# EAGLE design Explorer_Main_Board (EAGLE 7.5.0)
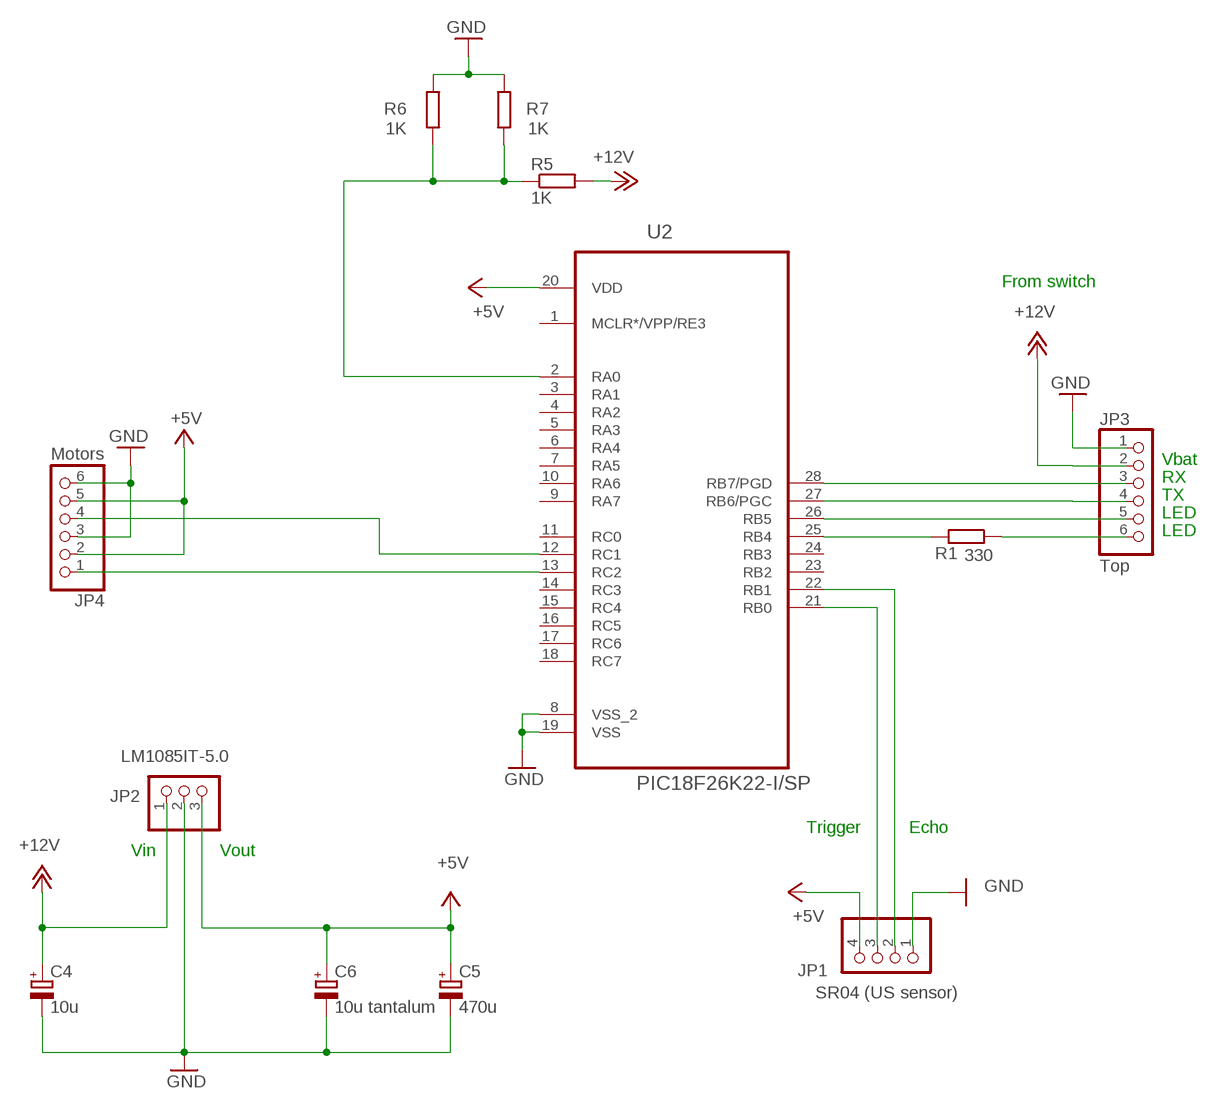
[diagram p0: schematic, sheet 1]

## Parts
C4  10u  CPOL-EUE2,5-6E  [E2,5-6E]
C5  470u  CPOL-EUE5-8.5  [E5-8,5]
C6  10u tantalum  CPOL-EUE2,5-6E  [E2,5-6E]
JP1  SR04 (US sensor)  PINHD-1X4  [1X04]
JP2  LM1085IT-5.0  PINHD-1X3  [1X03]
JP3  Top  PINHD-1X6  [1X06]
JP4  Motors  PINHD-1X6  [1X06]
R1  330  R-EU_0207/12  [0207/12]
R5  1K  R-EU_0207/12  [0207/12]
R6  1K  R-EU_0207/12  [0207/12]
R7  1K  R-EU_0207/12  [0207/12]
U2  PIC18F26K22-I/SP  [DIP254P762X508-28P]

## Nets
+5V: C5.+ C6.+ JP1.4 JP2.3 JP4.2 JP4.5 U2.20(VDD)
+12V: C4.+ JP2.1 JP3.2 R5.2
GND: C4.- C5.- C6.- JP1.1 JP2.2 JP3.1 JP4.3 JP4.6 R6.2 R7.2 U2.8(VSS_2) U2.19(VSS)
N$1: JP3.6 R1.1
N$2: R1.2 U2.25(RB4)
N$4: JP1.2 U2.22(RB1)
N$5: JP1.3 U2.21(RB0)
N$6: R5.1 R6.1 R7.1 U2.2(RA0)
N$11: JP3.3 U2.28(RB7/PGD)
N$12: JP3.4 U2.27(RB6/PGC)
N$13: JP4.4 U2.12(RC1)
N$14: JP4.1 U2.13(RC2)
N$18: JP3.5 U2.26(RB5)
Unconnected: U2.1(MCLR*/VPP/RE3) U2.3(RA1) U2.4(RA2) U2.5(RA3) U2.6(RA4) U2.7(RA5) U2.9(RA7) U2.10(RA6) U2.11(RC0) U2.14(RC3) U2.15(RC4) U2.16(RC5) U2.17(RC6) U2.18(RC7) U2.23(RB2) U2.24(RB3)

## Notes on the sheet
- From switch
- Vbat
- RX
- TX
- LED
- LED
- Trigger | Echo
- Vin | Vout

## Library data of the parts
C4-C6 = rcl:CPOL-EU: POLARIZED CAPACITOR, European symbol
JP1 = pinhead:PINHD-1X4: PIN HEADER
JP2 = pinhead:PINHD-1X3: PIN HEADER
JP3 JP4 = pinhead:PINHD-1X6: PIN HEADER
R1 R5-R7 = rcl:R-EU_: RESISTOR, European symbol
U2 = PIC18F26K22:PIC18F26K22-I/SP: MCU, 8BIT, 64K FLASH, XLP, SPDIP-28; MPN: PIC18F26K22-I/SP; OC_FARNELL: 1814975; OC_NEWARK: 65T6686; PACKAGE: SPDIP-28; SUPPLIER: MICROCHIP

## Board
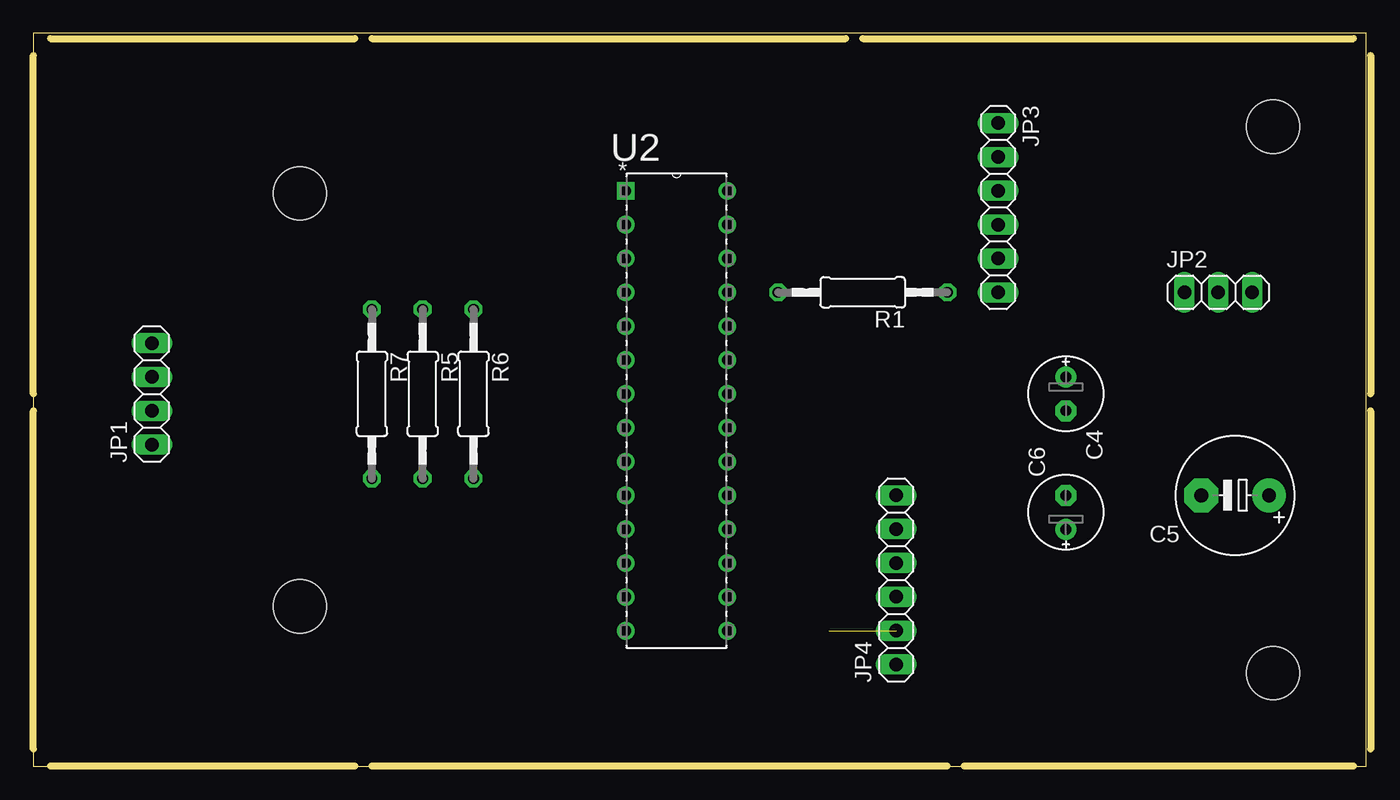
[diagram p1: board, top side]
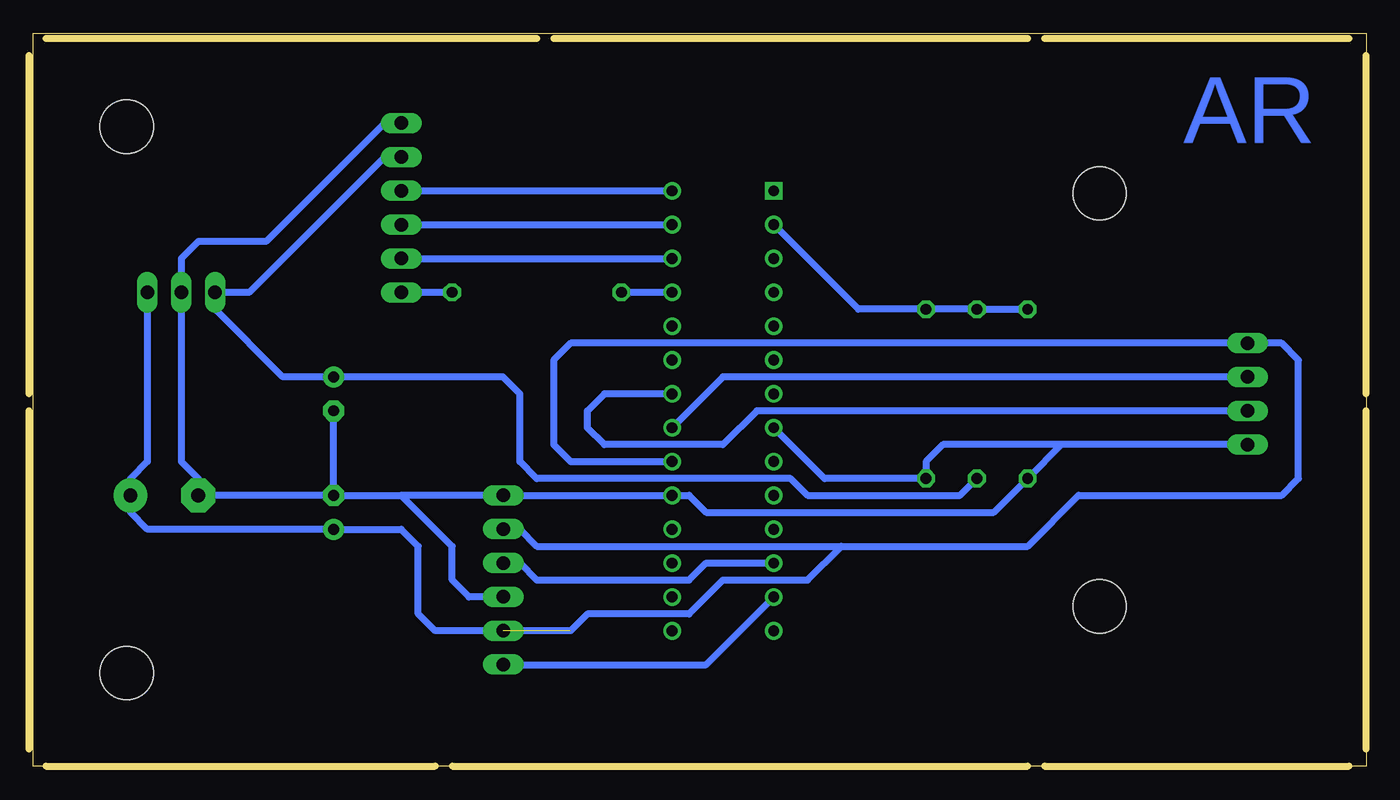
[diagram p2: board, bottom side, seen from below]

Size 100 x 55 mm. Coordinates in mm from the lower left corner, seen from the top.
Outline: 0,0 100,0 100,55 0,55 0,0
Copper layers (1*16): Top 0.035mm / dielectric 1.5mm / Bottom 0.035mm
Design rules "default *": minimum track width 20mil, minimum drill 24mil, track to track 20mil, track to pad 8mil, pad to pad 8mil, via to via 8mil, smd to smd 8mil, copper to edge 40mil, drill to drill 8mil, minimum pad ring 10mil, minimum via ring 8mil, stop-mask expansion 4mil, vias tented up to drill 0mil, thermal gap 10mil
Holes 4 mm at 93,48 93,7 20,43 20,12
Milling: 10 lines

### Footprints (pad centres in the part's own frame; a part is rotated, then mirrored left to right if it is on the bottom)
E2,5-6E = drill 0.813 pad 1.575: + -1.27,0 | drill 0.813 pad 1.575 octagon: - 1.27,0
E5-8,5 = drill 1.016 pad 2.54: + -2.54,0 | drill 1.016 pad 2.54 octagon: - 2.54,0
1X04 = drill 1.016 long: 1 -3.81,0; 2 -1.27,0; 3 1.27,0; 4 3.81,0
1X03 = drill 1.016 long: 1 -2.54,0; 2 0,0; 3 2.54,0
1X06 = drill 1.016 long: 1 -6.35,0; 2 -3.81,0; 3 -1.27,0; 4 1.27,0; 5 3.81,0; 6 6.35,0
0207/12 = drill 0.813 octagon: 1 -6.35,0; 2 6.35,0
DIP254P762X508-28P = drill 0.813 square: 1 -7.62,33.02 | drill 0.813: 2 -7.62,30.48; 3 -7.62,27.94; 4 -7.62,25.4; 5 -7.62,22.86; 6 -7.62,20.32; 7 -7.62,17.78; 8 -7.62,15.24; 9 -7.62,12.7; 10 -7.62,10.16; 11 -7.62,7.62; 12 -7.62,5.08; 13 -7.62,2.54; 14 -7.62,0; 15 0,0; 16 0,2.54; 17 0,5.08; 18 0,7.62; 19 0,10.16; 20 0,12.7; 21 0,15.24; 22 0,17.78; 23 0,20.32; 24 0,22.86; 25 0,25.4; 26 0,27.94; 27 0,30.48; 28 0,33.02

### Placement (x,y rotation side)
C4  77.47,27.94 270 top
C5  90.17,20.32 180 top
C6  77.47,19.05 90 top
JP1  8.89,27.94 90 top
JP2  88.9,35.56 0 top
JP3  72.39,41.91 270 top
JP4  64.74,13.98 90 top
R1  62.23,35.56 180 top
R5  29.21,27.94 270 top
R6  33.02,27.94 270 top
R7  25.4,27.94 270 top
U2  52.07,10.16 0 top

### Tracks (layer width: path | path; a pad name or v marks a point on that pad's centre or on a via)
+5V  (1 unrouted)
  Bottom 0.508: JP1.4 59.69,31.75 60.96,30.48 60.96,24.13 59.69,22.86 U2.20 | 64.77,10.16 JP4.2 | JP4.5 63.5,17.78 62.23,16.51 39.37,16.51 | 7.62,31.75 JP1.4 | JP1.4 6.35,31.75 5.08,30.48 5.08,21.59 6.35,20.32 21.59,20.32 25.4,16.51 39.37,16.51 | 39.37,16.51 41.91,13.97 48.26,13.97 50.8,11.43 58.42,11.43 59.69,10.16 69.85,10.16 71.12,11.43 71.12,16.51 72.39,17.78 C6.+ 91.44,17.78 92.71,19.05 C5.+ 92.71,21.59 91.44,22.86 JP2.3
+12V
  Bottom 0.508: R5.2 30.48,20.32 41.91,20.32 43.18,21.59 62.23,21.59 63.5,22.86 63.5,27.94 64.77,29.21 C4.+ 81.28,29.21 86.36,34.29 JP2.1 83.82,35.56 73.66,45.72 JP3.2
GND
  Bottom 0.508: 22.86,24.13 R7.2 27.94,19.05 49.53,19.05 50.8,20.32 U2.19 63.5,20.32 JP4.6 64.77,20.32 72.39,20.32 | JP1.1 22.86,24.13 | U2.8 40.64,21.59 R6.2 33.02,22.86 31.75,24.13 22.86,24.13 | 72.39,20.32 68.58,16.51 68.58,13.97 67.31,12.7 64.77,12.7 JP4.3 | C6.- 72.39,20.32 | C6.- C4.- | C6.- C5.- 87.63,21.59 88.9,22.86 JP2.2 88.9,38.1 87.63,39.37 82.55,39.37 73.66,48.26 JP3.1
N$1
  Bottom 0.508: R1.1 JP3.6
N$2
  Bottom 0.508: U2.25 R1.2
N$4
  Bottom 0.508: JP1.2 45.72,26.67 48.26,24.13 57.15,24.13 58.42,25.4 58.42,26.67 57.15,27.94 U2.22
N$5
  Bottom 0.508: U2.21 48.26,29.21 JP1.3
N$6
  Bottom 0.508: R7.1 R5.1 R6.1 38.1,34.29 U2.2
N$11
  Bottom 0.508: JP3.3 U2.28
N$12
  Bottom 0.508: JP3.4 U2.27
N$13
  Bottom 0.508: U2.12 49.53,15.24 50.8,13.97 62.23,13.97 63.5,15.24 JP4.4
N$14
  Bottom 0.508: U2.13 49.53,7.62 63.5,7.62 JP4.1
N$18
  Bottom 0.508: JP3.5 U2.26

### Text on the board
Bottom: AR